# EAGLE design amc7135-testboard-mk-1.0 (EAGLE 6.5.0)
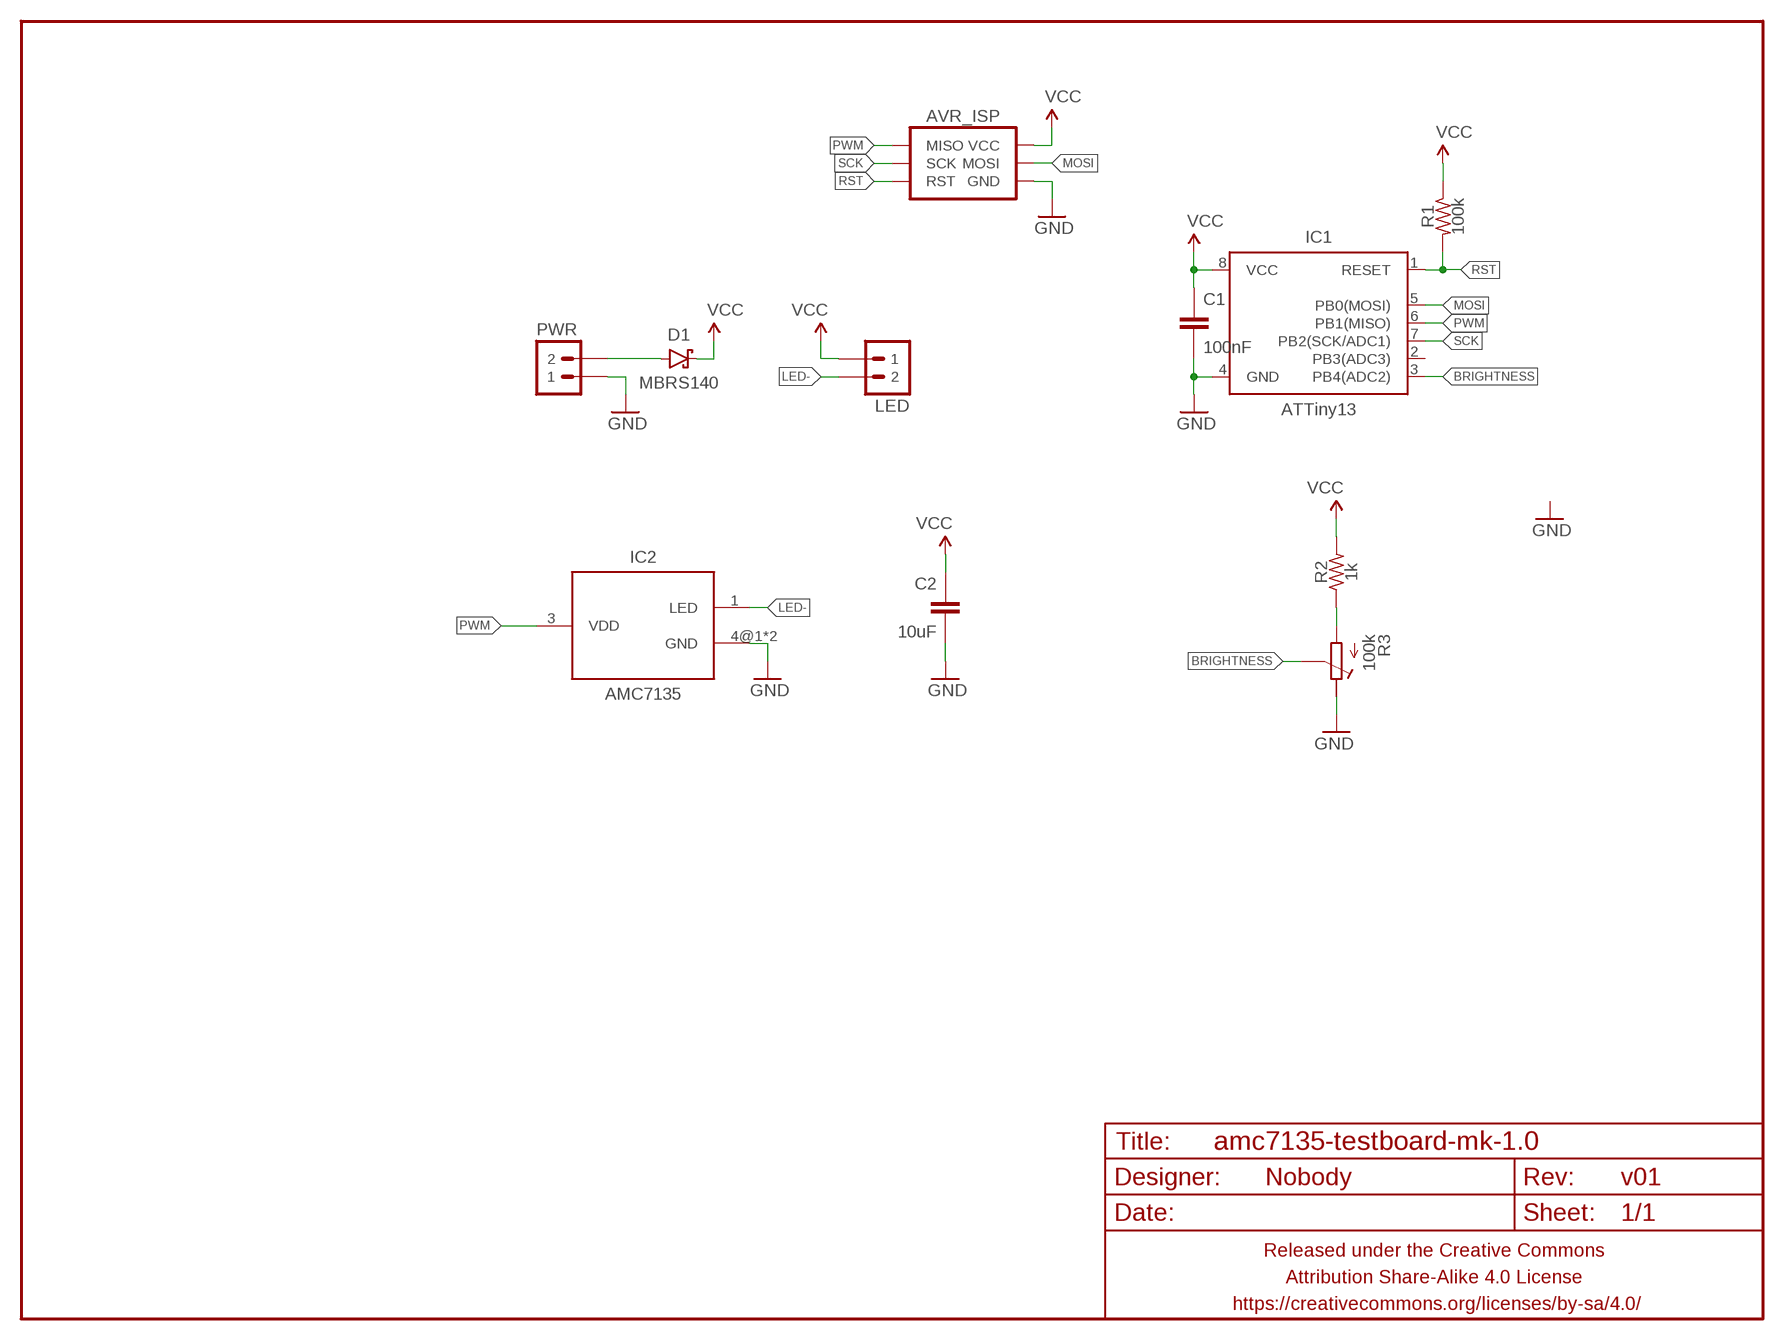
[diagram p0: schematic, sheet 1]

## Parts
AVR_ISP  AVR_SPI_PRG_6SMD_TEST_POINTS  [2X3_SMD_TEST_POINTS]
C1  100nF  CAPACITOR-CERAMICC0805  [C0805]
C2  10uF  CAPACITOR-CERAMICC0805  [C0805]
D1  MBRS140  DIODE-SCHOTTKYSMA  [SMA-DIODE-SCHOTTKY]
FRAME1  FRAME-LETTERNO_PACKAGE  [DUMMY]
IC1  ATTiny13  ATTINY13SOIC  [SO08]
IC2  AMC7135  AMC7135SOT-89-NOTHERM  [SOT89-NOTHERM]
LED  M02JST-PTH-RA-SMALLPADS  [JST-2-PH-RA-PTH-SMALLPADS]
PWR  M02JST-PTH-RA-SMALLPADS  [JST-2-PH-RA-PTH-SMALLPADS]
R1  100k  RESISTORR0805  [R0805]
R2  1k  RESISTORR0805  [R0805]
R3  100k  POTENTIOMETEREVM3Y  [EVM3Y]

## Nets
BRIGHTNESS: IC1.3(PB4(ADC2)) R3.S
GND: AVR_ISP.6(GND) C1.2 C2.2 IC1.4(GND) IC2.4@1(GND) IC2.4@2(GND) PWR.1 R3.E
LED-: IC2.1(LED) LED.2
MOSI: AVR_ISP.4(MOSI) IC1.5(PB0(MOSI))
N$1: R2.1 R3.A
N$2: D1.A PWR.2
PWM: AVR_ISP.1(MISO) IC1.6(PB1(MISO)) IC2.3(VDD)
RST: AVR_ISP.5(RST) IC1.1(RESET) R1.2
SCK: AVR_ISP.3(SCK) IC1.7(PB2(SCK/ADC1))
VCC: AVR_ISP.2(VCC) C1.1 C2.1 D1.C IC1.8(VCC) LED.1 R1.1 R2.2
Unconnected: IC1.2(PB3(ADC3))

## Library data of the parts
AVR_ISP = A_butts:AVR_SPI_PRG_6: AVR ISP 6 Pin This is the reduced ISP connector for AVR programming. Common on Arduino. This footprint will take up less PCB space and can be used with a 10-pin to 6-pin adapter such as SKU: BOB-08508 **Special note about "TEST_POINT" package. The stop mask is on the top side, so if you want your programming test points to be on the bottom of your board, make sure to place this package on the bottom side of the board. This also ensure that the orientation to program from the bottom side will be correct.
C1 C2 = A_butts:CAPACITOR-CERAMIC: CAPACITOR, European symbol
D1 = A_butts:DIODE-SCHOTTKY: Schottky diodes in SFE's production catalog BAT20J 1A 23V 0.62Vf RB751 120mA 40V 0.37Vf PMEG4005EJ 0.5A 40V 0.42Vf MBRA140 1A 40V 0.5Vf B340A 3A 40V SMA
FRAME1 = A_butts:FRAME-LETTER: Schematic Frame Standard 8.5x11 US Letter frame; DESIGNER: Nobody; VERSION: v01
IC1 = A_butts:ATTINY13: Atmel 8-pin 1kB flash uC
IC2 = A_butts:AMC7135
LED PWR = A_butts:M02: Standard 2-pin 0.1" header. Use with - straight break away headers ( PRT-00116) - right angle break away headers (PRT-00553) - swiss pins (PRT-00743) - machine pins (PRT-00117) - female headers (PRT-00115) Molex polarized connector foot print use with: PRT-08233 with associated crimp pins and housings. 2.54_SCREWTERM for use with PRT-10571. 3.5mm Screw Terminal footprints for PRT-08084 5mm Screw Terminal footprints for use with PRT-08433
R1 R2 = A_butts:RESISTOR: RESISTOR, American symbol
R3 = A_butts:POTENTIOMETER: Trimm resistor

## Board
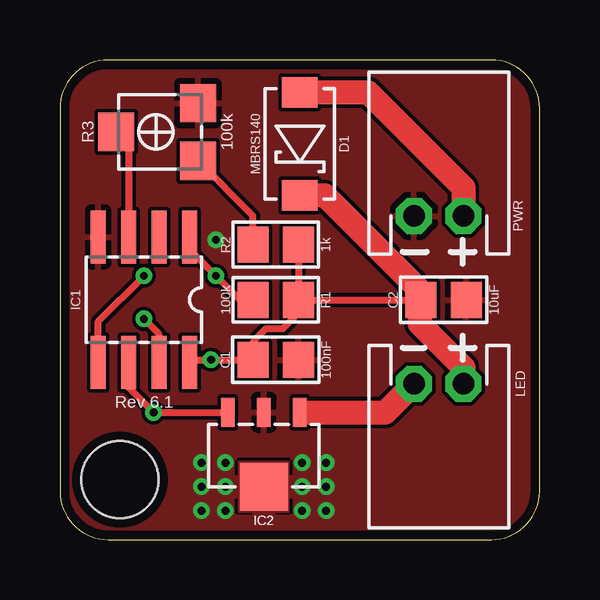
[diagram p1: board, top side]
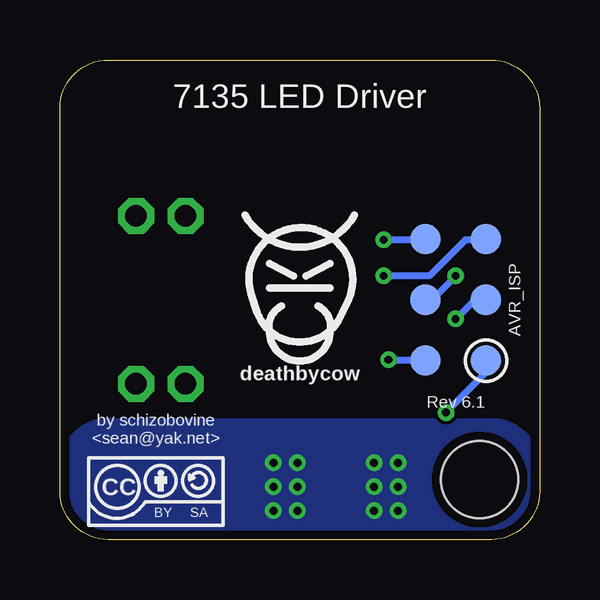
[diagram p2: board, bottom side, seen from below]

Size 20 x 20 mm. Coordinates in mm from the lower left corner, seen from the top.
Outline: 0,18 0,2 arc90 2,0 18,0 arc90 20,2 20,18 arc90 18,20 2,20 arc90 0,18
Copper layers (1*16): Top 0.0356mm / dielectric 1.5011mm / Bottom 0.0356mm
Design rules "LaenPCBOrder2": minimum track width 6mil, minimum drill 13mil, track to track 6mil, track to pad 6mil, pad to pad 6mil, via to via 6mil, smd to smd 6mil, copper to edge 15mil, drill to drill 6mil, minimum pad ring 7mil, minimum via ring 7mil, stop-mask expansion 3mil, vias tented up to drill 20mil, thermal gap 10mil
Holes 3.2 mm at 2.5,2.5
tRestrict: area 7.4,3.3 to 9.6,3.4; area 7.3,2.7 to 7.4,3.3; area 9.6,2.7 to 9.7,3.3; area 7.3,1.1 to 7.4,1.7; area 9.6,1.1 to 9.7,1.7; area 7.4,1.1 to 8,1.1; area 9,1.1 to 9.6,1.1

### Footprints (pad centres in the part's own frame; a part is rotated, then mirrored left to right if it is on the bottom)
2X3_SMD_TEST_POINTS = smd 1.27 x 1.27: 1 -2.54,-1.27; 2 -2.54,1.27; 3 0,-1.27; 4 0,1.27; 5 2.54,-1.27; 6 2.54,1.27
C0805 = smd 1.3 x 1.5: 1 -0.95,0; 2 0.95,0
SMA-DIODE-SCHOTTKY = smd 1.27 x 1.47: A -2.15,0; C 2.15,0
SO08 = smd 0.61 x 2.21: 1 -1.905,-2.616; 2 -0.635,-2.616; 3 0.635,-2.616; 4 1.905,-2.616; 5 1.905,2.616; 6 0.635,2.616; 7 -0.635,2.616; 8 -1.905,2.616
SOT89-NOTHERM = smd 0.58 x 1.2: 1 -1.5,-1.8; 3 1.5,-1.8; 4@1 0,-1.8 | smd 2 x 2: 4@2 0,1.3
JST-2-PH-RA-PTH-SMALLPADS = drill 0.9 pad 1.5 octagon: 1 -1.03,0; 2 1.03,0
R0805 = smd 1.3 x 1.5: 1 -0.95,0; 2 0.95,0
EVM3Y = smd 1.6 x 1.5: A -1.2,-1.75; E 1.2,-1.75; S 0,1.65

### Placement (x,y rotation side)
AVR_ISP  3.5,10 90 bottom
C1  9,7.5 0 top
C2  16,10 0 top
D1  10,16.5 270 top
FRAME1  -0.5,-0.5 0 top
IC1  3.5,10 180 top
IC2  8.5,3.5 180 top
LED  15.8,6.5 180 top
PWR  15.8,13.5 0 top
R1  9,10 180 top
R2  9,12.3 0 top
R3  4,17 90 top
U$1  [CC-BY-SA-4.0-NO-URL]  16,2 0 bottom
U$2  [COW_SMALL]  10,11 0 bottom

### Tracks (layer width: path | path; a pad name or v marks a point on that pad's centre or on a via)
BRIGHTNESS
  Top 0.3: R3.S 2.87,16.48 IC1.3
GND  (via drill 0.33)
  Bottom 0.3: AVR_ISP.6 4.81,12.5 v6.5,12.5
  other vias: 6.9,3.2 6.9,2.2 6.9,1.2 10.1,2.2 10.1,3.2 10.1,1.2 11.1,1.2 11.1,2.2 11.1,3.2 5.9,1.2 5.9,2.2 5.9,3.2
  pour Bottom (rank 6): 20,2 20,3 arc90 18,5 2,5 arc90 0,3 0,2 arc90 2,0 18,0 arc90
  pour Top: 0,18 0,2 arc90 2,0 18,0 arc90 20,2 20,18 arc90 18,20 2,20 arc90
LED-
  Top 0.5: IC2.1 10.3,5.3
  Top 1: 10.3,5.3 13.57,5.3 LED.2
MOSI  (via drill 0.33)
  Top 0.3: IC1.5 1.59,9.1 v3.5,11
  Bottom 0.3: v3.5,11 4.5,10 AVR_ISP.4
N$1
  Top 0.3: R2.1 8.05,13.5 R3.A
N$2
  Top 1: D1.A 12.85,18.65 16.83,14.67 PWR.2
PWM  (via drill 0.33)
  Top 0.3: IC1.6 2.87,6.33 v3.9,5.3 IC2.3
  Bottom 0.3: AVR_ISP.1 2.23,6.97 v3.9,5.3
RST  (via drill 0.33)
  Top 0.3: IC1.1 5.41,12.1 v6.5,11 7.5,10 R1.2
  Bottom 0.3: AVR_ISP.5 2.27,12.5 3.1,12.5 4.6,11 v6.5,11
SCK  (via drill 0.33)
  Top 0.3: IC1.7 4.13,8.56 v3.5,9.2
  Bottom 0.3: v3.5,9.2 2.7,10 AVR_ISP.3
VCC  (via drill 0.33)
  Top 0.3: IC1.8 5.52,7.5 v6.3,7.5 C1.1 8.1,7.55 8.1,8.3 8.6,8.8 9.3,8.8 9.95,9.45 R1.1 | R1.1 C2.1 | R2.2 R1.1
  Top 1: 15,10 C2.1 | C2.1 15.05,10.35 11.05,14.35 D1.C | C2.1 15,9.95 15,9 16.83,7.17 LED.1
  Bottom 0.3: v6.3,7.5 4.81,7.5 AVR_ISP.2

### Text on the board
bPlace: 7135 LED Driver | by schizobovine / <sean@yak.net>